# EAGLE design Lüftersteuerung (EAGLE 7.7.0)
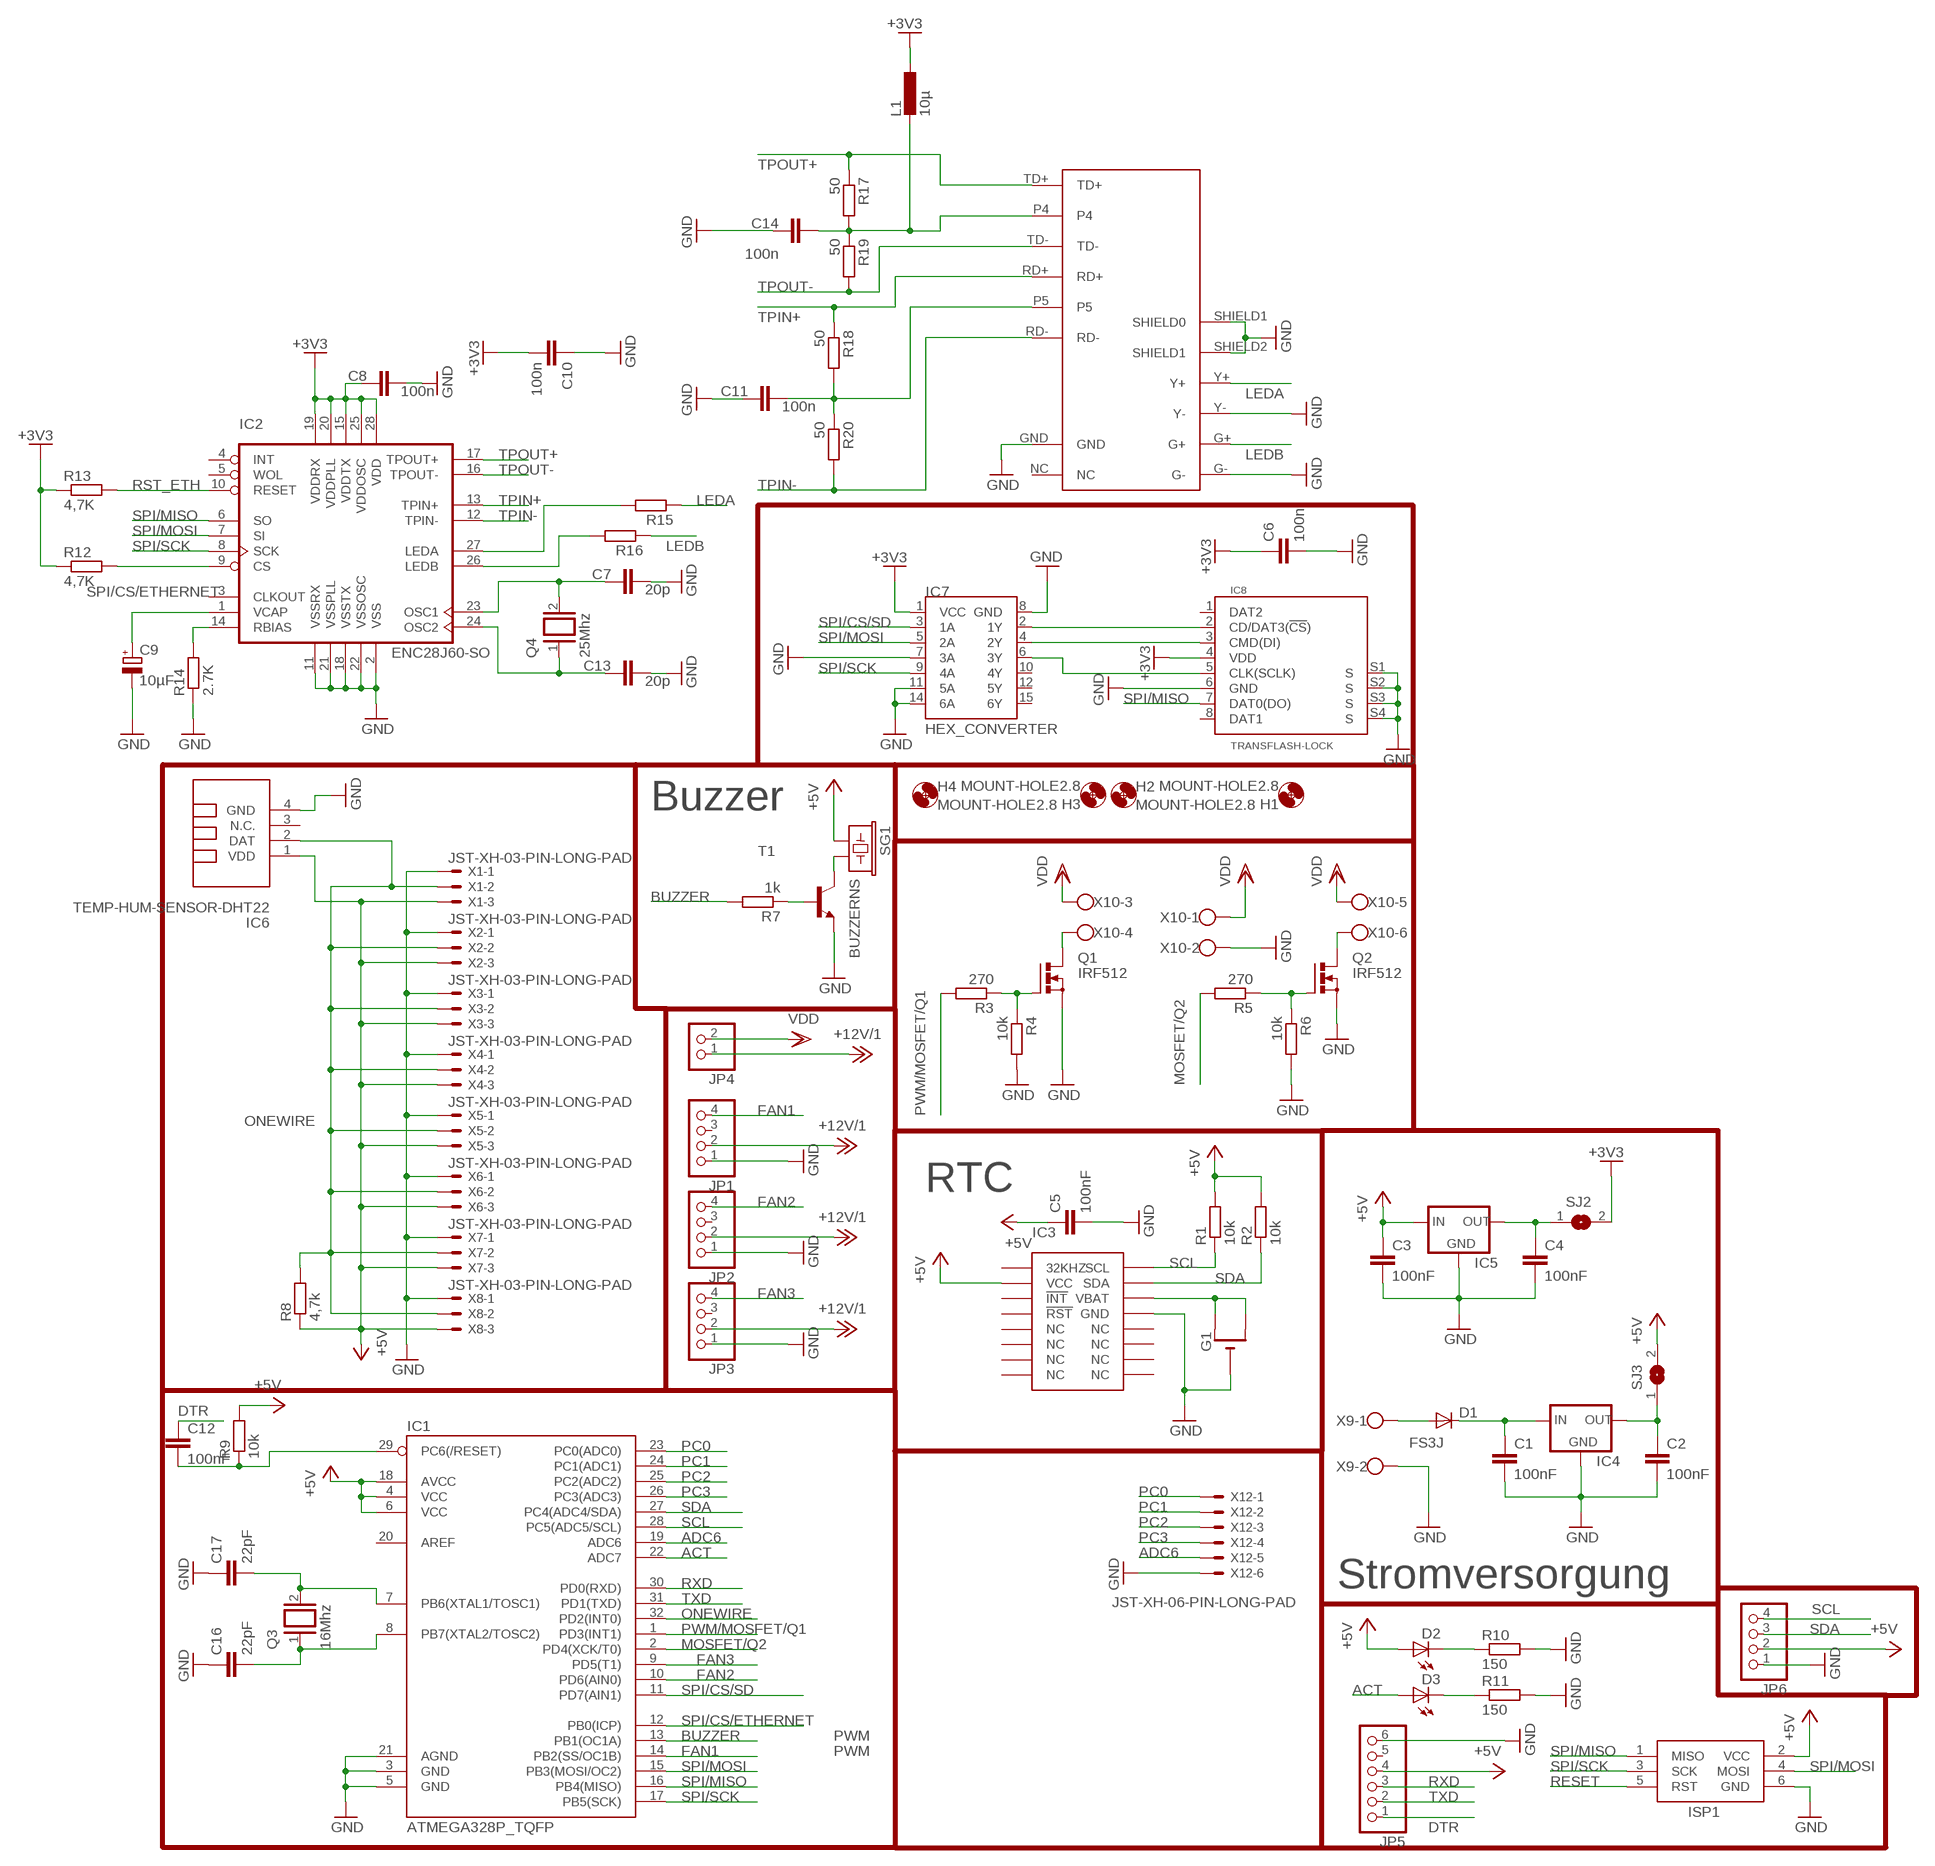
[diagram p0: schematic, sheet 1]

## Parts
C1  100nF  C-EUC1206  [C1206]
C2  100nF  C-EUC1206  [C1206]
C3  100nF  C-EUC1206  [C1206]
C4  100nF  C-EUC1206  [C1206]
C5  100nF  C-EUC1206  [C1206]
C6  100n  C-EUC1206  [C1206]
C7  20p  C-EUC1206  [C1206]
C8  100n  C-EUC1206  [C1206]
C9  10µF  CPOL-EUA/3216-18W  [A/3216-18W]
C10  100n  C-EUC1206  [C1206]
C11  100n  C-EUC1206  [C1206]
C12  100nF  C-EUC1206K  [C1206K]
C13  20p  C-EUC1206  [C1206]
C14  100n  C-EUC1206  [C1206]
C16  22pF  C-EUC1206K  [C1206K]
C17  22pF  C-EUC1206K  [C1206K]
D1  FS3J  DIODE-SMC  [SMC]
D2  LED3MM  [LED3MM]
D3  LED3MM  [LED3MM]
G1  CR1220SMT  [CR1220-SMD]
H1  MOUNT-HOLE2.8  [2,8]
H2  MOUNT-HOLE2.8  [2,8]
H3  MOUNT-HOLE2.8  [2,8]
H4  MOUNT-HOLE2.8  [2,8]
IC1  ATMEGA328P_TQFP  [TQFP32-08]
IC2  ENC28J60-SO  [SO28W]
IC3  DS3231SOIC-16W  [SOIC-16W]
IC4  LM1117  [SOT223]
IC5  LM1117  [SOT223]
IC6  TEMP-HUM-SENSOR-DHT22  [TEMP-HUM-SENSOR-DHT22]
IC7  HEX_CONVERTER  [SO016]
IC8  TRANSFLASH-LOCK  [TRANSFLASH-LOCK-SOCK]
ISP1  AVRISP-6  [AVRISP]
JP1  PINHD-1X4  [1X04]
JP2  PINHD-1X4  [1X04]
JP3  PINHD-1X4  [1X04]
JP4  PINHD-1X2  [1X02]
JP5  PINHD-1X6  [1X06]
JP6  PINHD-1X4  [1X04]
L1  10µ  L-EUL0805  [L0805]
Q1  IRF512  [TO220BV]
Q2  IRF512  [TO220BV]
Q3  16Mhz  XTAL/S  [QS]
Q4  25Mhz  XTAL/S  [QS]
R1  10k  R-EU_R1206  [R1206]
R2  10k  R-EU_R1206  [R1206]
R3  270  R-EU_R1206  [R1206]
R4  10k  R-EU_R1206  [R1206]
R5  270  R-EU_R1206  [R1206]
R6  10k  R-EU_R1206  [R1206]
R7  1k  R-EU_R1206  [R1206]
R8  4,7k  R-EU_R1206  [R1206]
R9  10k  R-EU_M1206  [M1206]
R10  150  R-EU_M1206  [M1206]
R11  150  R-EU_M1206  [M1206]
R12  4,7K  R-EU_R1206  [R1206]
R13  4,7K  R-EU_R1206  [R1206]
R14  2.7K  R-EU_R1206  [R1206]
R15  R-EU_R1206  [R1206]
R16  R-EU_R1206  [R1206]
R17  50  R-EU_R1206  [R1206]
R18  50  R-EU_R1206  [R1206]
R19  50  R-EU_R1206  [R1206]
R20  50  R-EU_R1206  [R1206]
SG1  BUZZERNS  [BUZZER-12MM-NS]
SJ2  SJ  [SJ]
SJ3  SJ  [SJ]
T1  BC817-16-NPN-SOT23-BEC  [SOT23-BEC]
U$1  HR911105A  [RJ45]
X1  JST-XH-03-PIN-LONG-PAD  [JST-XH-03-PACKAGE-LONG-PAD]
X2  JST-XH-03-PIN-LONG-PAD  [JST-XH-03-PACKAGE-LONG-PAD]
X3  JST-XH-03-PIN-LONG-PAD  [JST-XH-03-PACKAGE-LONG-PAD]
X4  JST-XH-03-PIN-LONG-PAD  [JST-XH-03-PACKAGE-LONG-PAD]
X5  JST-XH-03-PIN-LONG-PAD  [JST-XH-03-PACKAGE-LONG-PAD]
X6  JST-XH-03-PIN-LONG-PAD  [JST-XH-03-PACKAGE-LONG-PAD]
X7  JST-XH-03-PIN-LONG-PAD  [JST-XH-03-PACKAGE-LONG-PAD]
X8  JST-XH-03-PIN-LONG-PAD  [JST-XH-03-PACKAGE-LONG-PAD]
X9  W237-102  [W237-102]
X10  W237-6  [W237-6]
X12  JST-XH-06-PIN-LONG-PAD  [JST-XH-06-PACKAGE-LONG-PAD]

## Nets
+3V3: C6.1 C8.1 C10.2 IC2.15(VDDTX) IC2.19(VDDRX) IC2.20(VDDPLL) IC2.25(VDDOSC) IC2.28(VDD) IC7.1(VCC) IC8.4(VDD) L1.1 R12.1 R13.1 SJ2.2
+5V: C3.1 C5.1 D2.A IC1.4(VCC) IC1.6(VCC) IC1.18(AVCC) IC3.2(VCC) IC5.3(IN) IC6.1(VDD) ISP1.2(VCC) JP5.4 JP6.2 R1.2 R2.2 R8.1 R9.2 SG1.+ SJ3.2 X1.3 X2.3 X3.3 X4.3 X5.3 X6.3 X7.3 X8.3
+12V/1: JP1.2 JP2.2 JP3.2 JP4.1
ACT: D3.A IC1.22(ADC7)
ADC6: IC1.19(ADC6) X12.5
BUZZER: IC1.13(PB1(OC1A)) R7.2
DTR: C12.1 JP5.1
FAN1: IC1.14(PB2(SS/OC1B)) JP1.4
FAN2: IC1.10(PD6(AIN0)) JP2.4
FAN3: IC1.9(PD5(T1)) JP3.4
GND: C1.2 C2.2 C3.2 C4.2 C5.2 C6.2 C7.2 C8.2 C9.- C10.1 C11.1 C13.1 C14.1 C16.1 C17.1 G1.- IC1.3(GND) IC1.5(GND) IC1.21(AGND) IC2.2(VSS) IC2.11(VSSRX) IC2.18(VSSTX) IC2.21(VSSPLL) IC2.22(VSSOSC) IC3.13(GND) IC4.1(GND) IC5.1(GND) IC6.4(GND) IC7.7(3A) IC7.8(GND) IC7.11(5A) IC7.14(6A) IC8.6(GND) IC8.S1(S) IC8.S2(S) IC8.S3(S) IC8.S4(S) ISP1.6(GND) JP1.1 JP2.1 JP3.1 JP5.6 JP6.1 Q1.S Q2.S R4.2 R6.2 R10.2 R11.2 R14.1 T1.E U$1.G- U$1.GND U$1.SHIELD1(SHIELD0) U$1.SHIELD2(SHIELD1) U$1.Y- X1.1 X2.1 X3.1 X4.1 X5.1 X6.1 X7.1 X8.1 X9.2 X10.2 X12.6
LEDA: R15.1 U$1.Y+
LEDB: R16.1 U$1.G+
MOSFET/Q2: IC1.2(PD4(XCK/T0)) R5.2
N$1: D1.A X9.1
N$2: C1.1 D1.C IC4.3(IN)
N$3: C2.1 IC4.2(OUT) SJ3.1
N$4: G1.+$1(+) G1.+$2(+1) IC3.14(VBAT)
N$5: Q1.D X10.4
N$6: Q1.G R3.1 R4.1
N$7: Q2.D X10.6
N$8: SG1.- T1.C
N$9: Q2.G R5.1 R6.1
N$10: R7.1 T1.B
N$11: C16.2 IC1.8(PB7(XTAL2/TOSC2)) Q3.1
N$12: C17.2 IC1.7(PB6(XTAL1/TOSC1)) Q3.2
N$13: D2.K(C) R10.1
N$14: D3.K(C) R11.1
N$15: IC7.2(1Y) IC8.2(CD/DAT3(!CS!))
N$16: IC7.4(2Y) IC8.3(CMD(DI))
N$17: IC7.6(3Y) IC8.5(CLK(SCLK))
N$18: C13.2 IC2.24(OSC2) Q4.1
N$19: IC2.14(RBIAS) R14.2
N$20: C7.1 IC2.23(OSC1) Q4.2
N$21: C9.+ IC2.1(VCAP)
N$22: C14.2 L1.2 R17.2 R19.1 U$1.P4
N$23: IC2.26(LEDB) R16.2
N$24: IC2.27(LEDA) R15.2
N$26: C11.2 R18.2 R20.1 U$1.P5
N$42: C4.1 IC5.2(OUT) SJ2.1
ONEWIRE: IC1.32(PD2(INT0)) IC6.2(DAT) R8.2 X1.2 X2.2 X3.2 X4.2 X5.2 X6.2 X7.2 X8.2
PC0: IC1.23(PC0(ADC0)) X12.1
PC1: IC1.24(PC1(ADC1)) X12.2
PC2: IC1.25(PC2(ADC2)) X12.3
PC3: IC1.26(PC3(ADC3)) X12.4
PWM/MOSFET/Q1: IC1.1(PD3(INT1)) R3.2
RESET: C12.2 IC1.29(PC6(/RESET)) ISP1.5(RST) R9.1
RST_ETH: IC2.10(RESET) R13.2
RXD: IC1.30(PD0(RXD)) JP5.3
SCL: IC1.28(PC5(ADC5/SCL)) IC3.16(SCL) JP6.4 R1.1
SDA: IC1.27(PC4(ADC4/SDA)) IC3.15(SDA) JP6.3 R2.1
SPI/CS/ETHERNET: IC1.12(PB0(ICP)) IC2.9(CS) R12.2
SPI/CS/SD: IC1.11(PD7(AIN1)) IC7.3(1A)
SPI/MISO: IC1.16(PB4(MISO)) IC2.6(SO) IC8.7(DAT0(DO)) ISP1.1(MISO)
SPI/MOSI: IC1.15(PB3(MOSI/OC2)) IC2.7(SI) IC7.5(2A) ISP1.4(MOSI)
SPI/SCK: IC1.17(PB5(SCK)) IC2.8(SCK) IC7.9(4A) ISP1.3(SCK)
TPIN+: IC2.13(TPIN+) R18.1 U$1.RD+
TPIN-: IC2.12(TPIN-) R20.2 U$1.RD-
TPOUT+: IC2.17(TPOUT+) R17.1 U$1.TD+
TPOUT-: IC2.16(TPOUT-) R19.2 U$1.TD-
TXD: IC1.31(PD1(TXD)) JP5.2
VDD: JP4.2 X10.1 X10.3 X10.5
Unconnected: IC1.20(AREF) IC2.3(CLKOUT) IC2.4(INT) IC2.5(WOL) IC3.1(32KHZ) IC3.3(!INT) IC3.4(!RST) IC3.5(NC) IC3.6(NC) IC3.7(NC) IC3.8(NC) IC3.9(NC) IC3.10(NC) IC3.11(NC) IC3.12(NC) IC6.3(N.C.) IC7.10(4Y) IC7.12(5Y) IC7.15(6Y) IC8.1(DAT2) IC8.8(DAT1) JP1.3 JP2.3 JP3.3 JP5.5 U$1.NC

## Notes on the sheet
- Buzzer
- RTC
- Stromversorgung
- PWM
- PWM

## Library data of the parts
C1-C8 C10-C14 C16 C17 = rcl:C-EU: CAPACITOR, European symbol
C9 = rcl:CPOL-EU: POLARIZED CAPACITOR, European symbol
D1 = diode-1:DIODE-: DIODE
D2 D3 = SparkFun:LED: LEDs Standard schematic elements and footprints for 5mm, 3mm, 1206, and 0603 sized LEDs. 5mm - Spark Fun Electronics SKU : COM-00529 (and others)
G1 = adafruit:CR1220: CR1216/CR1220/CR1225 12mm 3V lithium coin cell Great for battery packup. Both SMT and THM holders. Note the THM package has the ground pads on both sides of the PCB so that the masks are the same - this reduces the cost
H1-H4 = holes:MOUNT-HOLE: MOUNTING HOLE with drill center marker
IC1 = SparkFun-IC-Microcontroller:ATMEGA328P_TQFP: Popular 328P in QFP Storefront component: ATmega328 - TQFP <https://www.sparkfun.com/products/13448> (COM-13448) Datasheet <http://www.sparkfun.com/datasheets/Components/SMD/ATMega328.pdf> SparkFun Products SparkFun RedBoard - Programmed with Arduino <https://www.sparkfun.com/products/12757> (DEV-12757) Arduino Pro Mini 328 - 5V/16MHz <https://www.sparkfun.com/products/11113> (DEV-11113) Arduino Pro Mini 328 - 3.3V/8MHz <https://www.sparkfun.com/products/11114> (DEV-11114) SparkFun OpenLog <https://www.sparkfun.com/products/13712> (DEV-13712) SparkFun MicroView - OLED Arduino Module <https://www.sparkfun.com/products/12923> (DEV-12923) SparkFun Digital Sandbox <https://www.sparkfun.com/products/12651> (DEV-12651) SparkFun PicoBoard <https://www.sparkfun.com/products/11888> (WIG-11888) Arduino Fio <https://www.sparkfun.com/products/10116> (DEV-10116) LilyPad Arduino 328 Main Board <https://www.sparkfun.com/products/13342> (DEV-13342) SparkFun RedStick <https://www.sparkfun.com/products/13741> (DEV-13741) LilyPad MP3 <https://www.sparkfun.com/products/11013> (DEV-11013) LilyPad Arduino SimpleSnap <https://www.sparkfun.com/products/10941> (DEV-10941) SparkFun Stepoko <https://www.sparkfun.com/products/13899> (ROB-13899) SparkFun Geiger Counter <https://www.sparkfun.com/products/11345> (SEN-11345) SparkFun EL Sequencer <https://www.sparkfun.com/products/12781> (COM-12781) Arduino Pro 328 - 5V/16MHz <https://www.sparkfun.com/products/10915> (DEV-10915) CryptoCape <https://www.sparkfun.com/products/12773> (DEV-12773) SparkFun IR Thermometer Evaluation Board - MLX90614 <https://www.sparkfun.com/products/10740> (SEN-10740) SparkFun RedBot Mainboard <https://www.sparkfun.com/products/12097> (ROB-12097) Arduino Pro 328 - 3.3V/8MHz <https://www.sparkfun.com/products/10914> (DEV-10914) SparkFun Block for Intel® Edison - Arduino <https://www.sparkfun.com/products/13036> (DEV-13036) SparkFun Simon Says - Surface Mount Soldering Kit <https://www.sparkfun.com/products/10935> (KIT-10935) SparkFun 7-Segment Serial Display - Red <https://www.sparkfun.com/products/11441> (COM-11441) SparkFun 7-Segment Serial Display - White <https://www.sparkfun.com/products/11629> (COM-11629) SparkFun 7-Segment Serial Display - Yellow <https://www.sparkfun.com/products/11443> (COM-11443) SparkFun 7-Segment Serial Display - Kelly Green <https://www.sparkfun.com/products/11440> (COM-11440) SparkFun 7-Segment Serial Display - Blue <https://www.sparkfun.com/products/11442> (COM-11442) SparkFun OpenSegment Serial Display - 20mm (Blue) <https://www.sparkfun.com/products/11647> (COM-11647) SparkFun OpenSegment Serial Display - 20mm (Green) <https://www.sparkfun.com/products/11646> (COM-11646) SparkFun OpenSegment Serial Display - 20mm (White) <https://www.sparkfun.com/products/11648> (COM-11648) SparkFun OpenSegment Serial Display - 20mm (Red) <https://www.sparkfun.com/products/11644> (COM-11644) SparkFun OpenSegment Serial Display - 20mm (Yellow) <https://www.sparkfun.com/products/11645> (COM-11645) SparkFun OpenSegment Shield <https://www.sparkfun.com/products/13190> (DEV-13190); PROD_ID: IC-09069
IC2 = microchip-enc28j60:ENC28J60-*: Microchip 10Mbit Eth. contoller with SPI interface
IC3 = DS3231_industrialberry:DS3231
IC4 IC5 = v-reg-2:LM1117
IC6 = diy-modules:TEMP-HUM-SENSOR-DHT22: DHT22 - digital humidity & temperature sensor Also known as: AM2302 AM2302 datasheet available here: http://akizukidenshi.com/download/ds/aosong/AM2302.pdf Click here to find device on ebay.com <http://www.ebay.com/sch/dht22+digital+sensor>
IC7 = SparkFun-DigitalIC:HEX_CONVERTER: 74HC4050 Hex Buffer Level Shifter SMD SO016; PROD_ID: IC-09604
IC8 = SD-Kartenhalter:TRANSFLASH: TransFlash TF Micro SD Card Socket Adapter
ISP1 = adafruit:AVRISP: AVR ISP HEADER Standard 6 pin header for AVR programming
JP1-JP3 JP6 = pinhead:PINHD-1X4: PIN HEADER
JP4 = pinhead:PINHD-1X2: PIN HEADER
JP5 = pinhead:PINHD-1X6: PIN HEADER
L1 = rcl:L-EU: INDUCTOR, European symbol
Q1 Q2 = transistor-power:IRF512: N-CHANNEL MOS FET
Q3 Q4 = special:XTAL/S: CRYSTAL
R1-R20 = rcl:R-EU_: RESISTOR, European symbol
SG1 = SparkFun:BUZZER: Buzzer 12mm Spark Fun Electronics SKU : Comp-Buzzer
SJ2 SJ3 = jumper:SJ: SMD solder JUMPER
T1 = transistor:*-NPN-: NPN Transistror BF959 corrected 2008.03.06
U$1 = HR911105A:HR911105A
X1-X8 = Rembrandt Electronics - JST XH Connectors v1-0:JST-XH-03-PIN: JST XH Connector 2 Pin Wire to board connector. Pitch: 2,54 mm, (0.100") Number of pins: 3 Created by Rembrandt Electronics www.rembrandtelectronics.com
X9 = con-wago-500:W237-102: WAGO SCREW CLAMP
X10 = con-wago-500:W237-6: WAGO SCREW CLAMP
X12 = Rembrandt Electronics - JST XH Connectors v1-0:JST-XH-06-PIN: JST XH Connector 2 Pin Wire to board connector. Pitch: 2,54 mm, (0.100") Number of pins: 6 Created by Rembrandt Electronics www.rembrandtelectronics.com

## Board
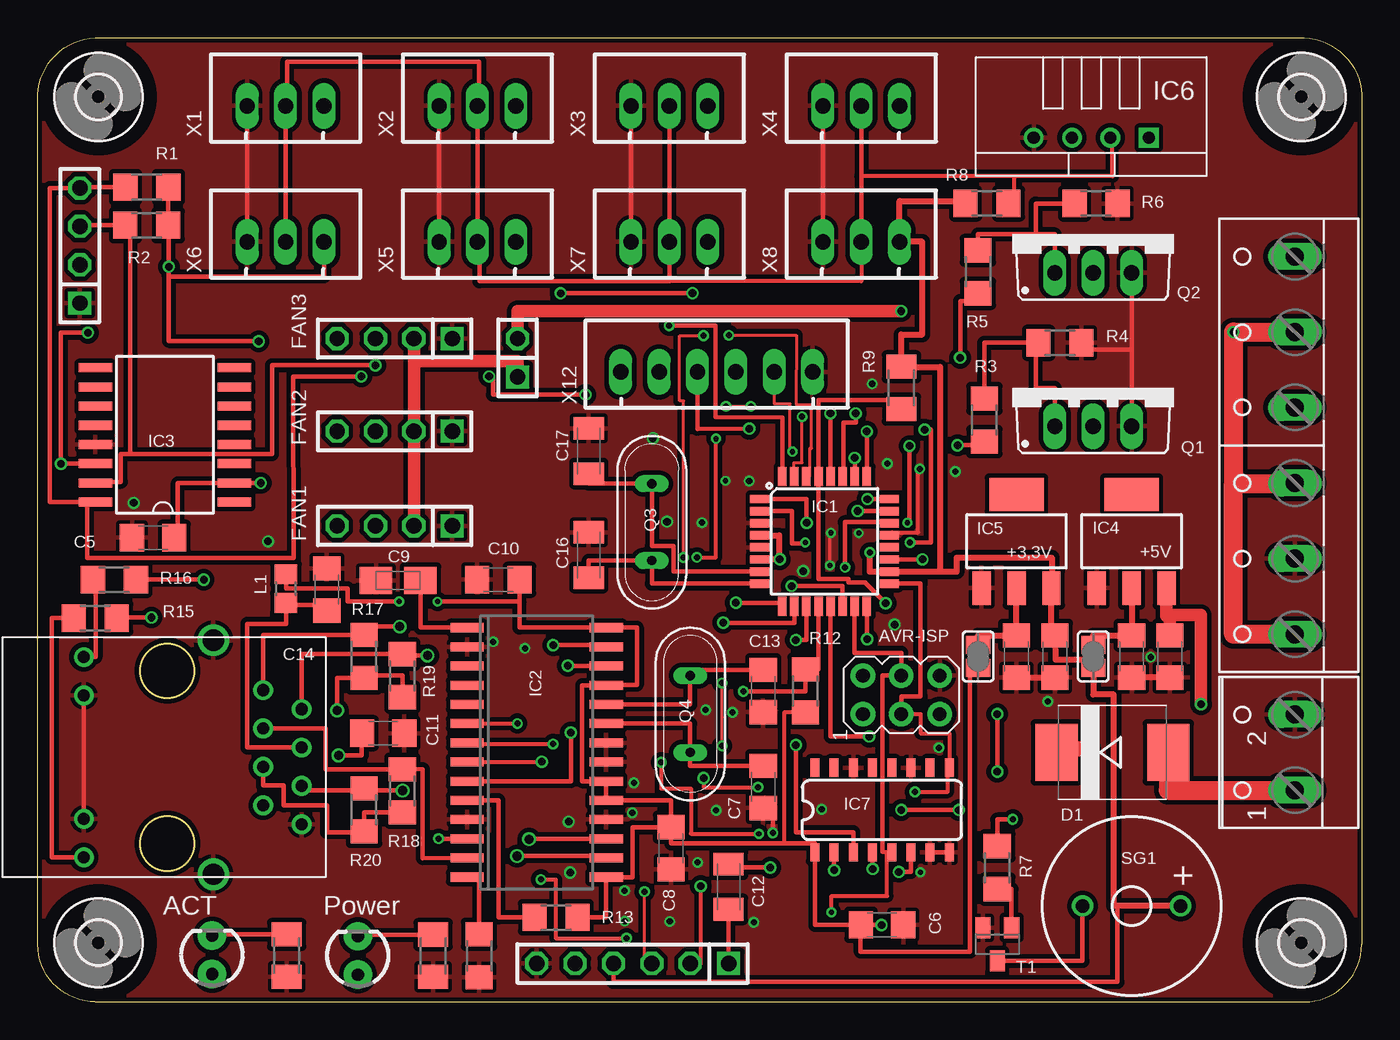
[diagram p1: board, top side]
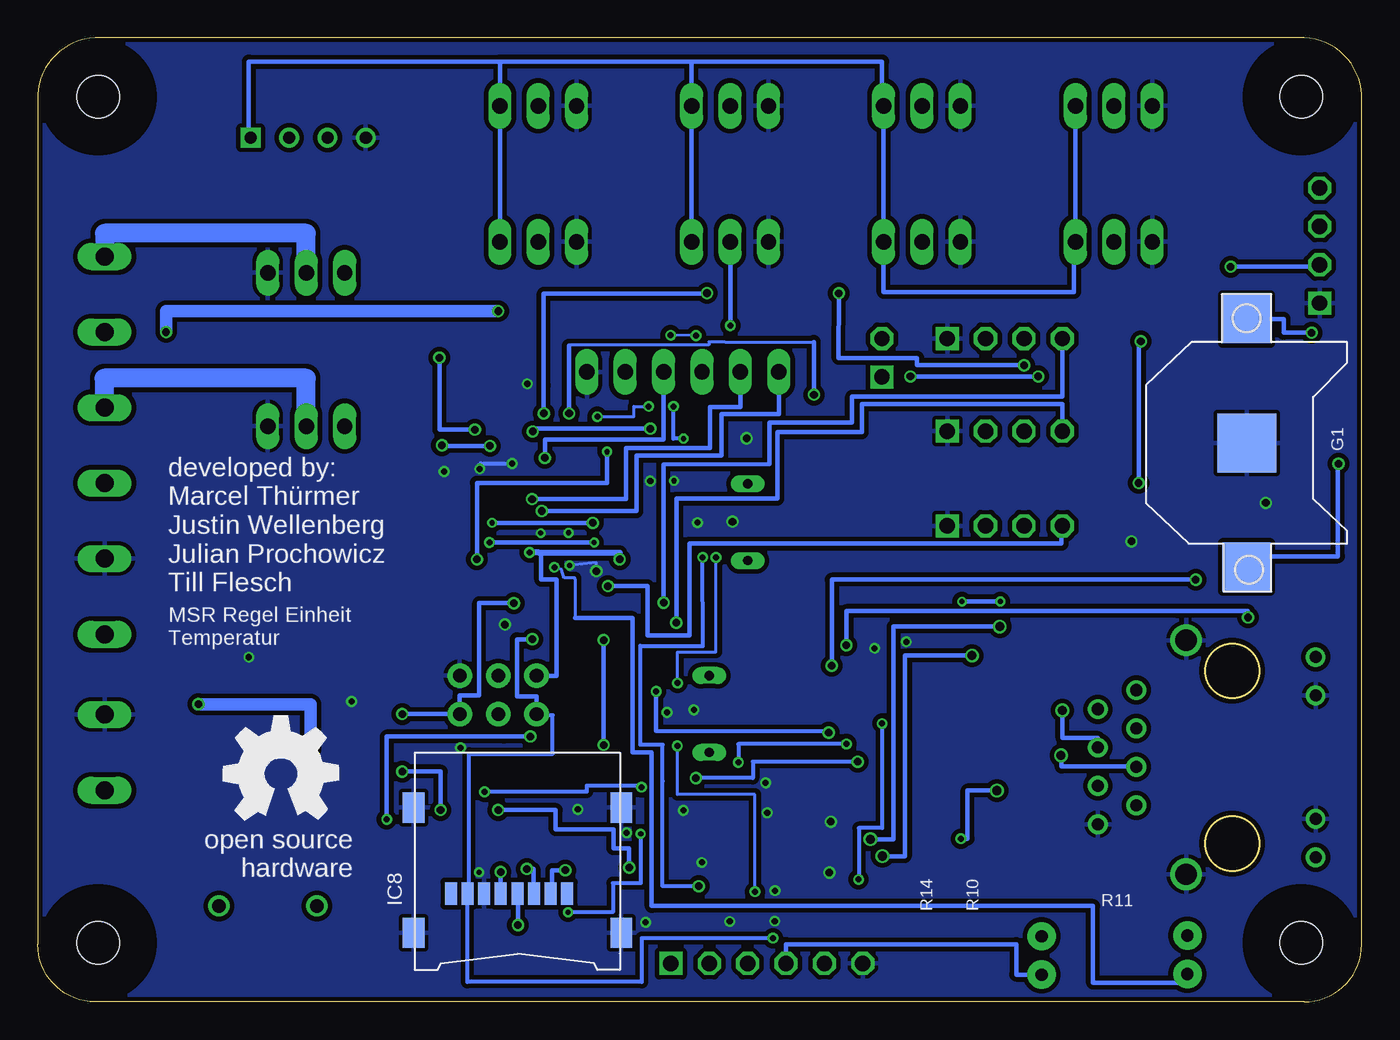
[diagram p2: board, bottom side, seen from below]

Size 87.62 x 63.81 mm. Coordinates in mm from the lower left corner, seen from the top.
Outline: 83.81,0 3.81,0 arc-90 0,3.81 0,59.69 arc-90 3.81,63.81 83.82,63.81 arc-90 87.62,59.69 87.62,3.81 arc-90 83.82,0
Copper layers (1*16): Top 0.035mm / dielectric 1.5mm / Bottom 0.035mm
Design rules "SeeedStudio_2layer_DRU_no_angle_20140221 *": minimum track width 6mil, minimum drill 12mil, track to track 6mil, track to pad 6mil, pad to pad 6mil, via to via 6mil, smd to smd 0mil, copper to edge 10mil, drill to drill 0.3mm, minimum pad ring 10mil, minimum via ring 6mil, stop-mask expansion 2mil, vias tented up to drill 0mil, thermal gap 10mil

### Footprints (pad centres in the part's own frame; a part is rotated, then mirrored left to right if it is on the bottom)
C1206 = smd 1.6 x 1.8: 1 -1.4,0; 2 1.4,0
A/3216-18W = smd 2.15 x 1.8: + 1.475,0; - -1.475,0
C1206K = smd 1.5 x 2: 1 -1.5,0; 2 1.5,0
SMC = smd 2.8 x 3.8: A 3.7,0; C -3.7,0
LED3MM = drill 0.813 pad 1.88: A -1.27,0; K 1.27,0
CR1220-SMD = smd 3.2 x 3.2: +$1 -8.2,0; +$2 8.2,0 | smd 3.9 x 3.9: - 0,0
2,8 = hole 2.8: 0,0
TQFP32-08 = smd 1.27 x 0.559: 1 -4.293,2.8; 2 -4.293,2; 3 -4.293,1.2; 4 -4.293,0.4; 5 -4.293,-0.4; 6 -4.293,-1.2; 7 -4.293,-2; 8 -4.293,-2.8; 17 4.293,-2.8; 18 4.293,-2; 19 4.293,-1.2; 20 4.293,-0.4; 21 4.293,0.4; 22 4.293,1.2; 23 4.293,2; 24 4.293,2.8 | smd 0.559 x 1.27: 9 -2.8,-4.293; 10 -2,-4.293; 11 -1.2,-4.293; 12 -0.4,-4.293; 13 0.4,-4.293; 14 1.2,-4.293; 15 2,-4.293; 16 2.8,-4.293; 25 2.8,4.293; 26 2,4.293; 27 1.2,4.293; 28 0.4,4.293; 29 -0.4,4.293; 30 -1.2,4.293; 31 -2,4.293; 32 -2.8,4.293
SO28W = smd 0.6 x 2.2: 1 -8.255,-4.6; 2 -6.985,-4.6; 3 -5.715,-4.6; 4 -4.445,-4.6; 5 -3.175,-4.6; 6 -1.905,-4.6; 7 -0.635,-4.6; 8 0.635,-4.6; 9 1.905,-4.6; 10 3.175,-4.6; 11 4.445,-4.6; 12 5.715,-4.6; 13 6.985,-4.6; 14 8.255,-4.6; 15 8.255,4.6; 16 6.985,4.6; 17 5.715,4.6; 18 4.445,4.6; 19 3.175,4.6; 20 1.905,4.6; 21 0.635,4.6; 22 -0.635,4.6; 23 -1.905,4.6; 24 -3.175,4.6; 25 -4.445,4.6; 26 -5.715,4.6; 27 -6.985,4.6; 28 -8.255,4.6
SOIC-16W = smd 0.6 x 2.2: 1 -4.445,-4.6; 2 -3.175,-4.6; 3 -1.905,-4.6; 4 -0.635,-4.6; 5 0.635,-4.6; 6 1.905,-4.6; 7 3.175,-4.6; 8 4.445,-4.6; 9 4.445,4.6; 10 3.175,4.6; 11 1.905,4.6; 12 0.635,4.6; 13 -0.635,4.6; 14 -1.905,4.6; 15 -3.175,4.6; 16 -4.445,4.6
SOT223 = smd 1.219 x 2.235: 1 -2.311,-3.099; 2 0,-3.099; 3 2.311,-3.099 | smd 3.6 x 2.2: 4 0,3.099
TEMP-HUM-SENSOR-DHT22 = drill 0.8 square: 1 -3.81,0 | drill 0.8: 2 -1.27,0; 3 1.27,0; 4 3.81,0
SO016 = smd 0.6 x 1.2: 1 -4.445,-2.8; 2 -3.175,-2.8; 3 -1.905,-2.8; 4 -0.635,-2.8; 5 0.635,-2.8; 6 1.905,-2.8; 7 3.175,-2.8; 8 4.445,-2.8; 9 4.445,2.8; 10 3.175,2.8; 11 1.905,2.8; 12 0.635,2.8; 13 -0.635,2.8; 14 -1.905,2.8; 15 -3.175,2.8; 16 -4.445,2.8
TRANSFLASH-LOCK-SOCK = smd 0.8 x 1.5: 1 3.3,-0.46; 2 2.2,-0.46; 3 1.1,-0.46; 4 0,-0.46; 5 -1.1,-0.46; 6 -2.2,-0.46; 7 -3.3,-0.46; 8 -4.4,-0.46 | smd 1.45 x 2: S1 -6.875,-3.06; S2 -6.875,5.24; S3 6.875,5.24; S4 6.875,-3.06
AVRISP = drill 0.9 pad 1.626: 1 -1.27,2.54; 2 1.27,2.54; 3 -1.27,0; 4 1.27,0; 5 -1.27,-2.54; 6 1.27,-2.54
1X04 = drill 1.016 square: 1 -3.81,0 | drill 1.016 octagon: 2 -1.27,0; 3 1.27,0; 4 3.81,0
1X02 = drill 1.016 square: 1 -1.27,0 | drill 1.016 octagon: 2 1.27,0
1X06 = drill 1.016 square: 1 -6.35,0 | drill 1.016 octagon: 2 -3.81,0; 3 -1.27,0; 4 1.27,0; 5 3.81,0; 6 6.35,0
L0805 = smd 1.3 x 1.5: 1 -0.95,0; 2 0.95,0
TO220BV = drill 1.016 long: D 0,-2.54; G -2.54,-2.54; S 2.54,-2.54
QS = drill 0.61 long: 1 -2.54,0; 2 2.54,0
R1206 = smd 1.6 x 1.803: 1 -1.422,0; 2 1.422,0
M1206 = smd 1.6 x 2: 1 -1.4,0; 2 1.4,0
BUZZER-12MM-NS = drill 0.9: + 3.25,0; - -3.25,0
SJ = smd 1.168 x 1.6: 1 -0.762,0; 2 0.762,0
SOT23-BEC = smd 1 x 1.4: B -0.95,-1.1; C 0,1.1; E 0.95,-1.1
RJ45 = drill 0.8: G+ 5.84,-6.305; G- 5.84,-3.765; GND -8.57,4.76; NC -6.03,3.5; P4 -8.57,-0.32; P5 -6.03,0.96; RD+ -6.03,-1.58; RD- -8.57,2.22; TD+ -6.03,-4.12; TD- -8.57,-2.86; Y+ 5.84,6.945; Y- 5.84,4.405 | drill 1.4: SHIELD1 -2.73,-7.425; SHIELD2 -2.73,8.065
JST-XH-03-PACKAGE-LONG-PAD = drill 1.016 long: 1 -2.54,0; 2 0,0; 3 2.54,0
W237-102 = drill 1.194 long: 1 -2.5,-1.27; 2 2.5,-1.27
W237-6 = drill 1.194 long: 1 -12.5,-1.27; 2 -7.5,-1.27; 3 -2.5,-1.27; 4 2.5,-1.27; 5 7.5,-1.27; 6 12.5,-1.27
JST-XH-06-PACKAGE-LONG-PAD = drill 1.016 long: 1 -6.35,0; 2 -3.81,0; 3 -1.27,0; 4 1.27,0; 5 3.81,0; 6 6.35,0

### Placement (x,y rotation side)
C1  74.93,22.86 270 top
C2  72.39,22.86 270 top
C3  67.31,22.86 270 top
C4  64.77,22.86 270 top
C5  7.63,30.72 180 top
C6  55.87,5.1 0 top
C7  48.01,14.22 270 top
C8  41.91,10.16 270 top
C9  23.85,27.9 0 top
C10  30.48,27.94 0 top
C11  22.86,17.78 180 top
C12  45.72,7.62 90 top
C13  48.01,20.57 90 top
C14  19.13,27.29 270 top
C16  36.46,29.58 270 top
C17  36.46,36.46 270 top
D1  71.12,16.51 0 top
D2  21.19,3.07 90 top
D3  11.54,3.11 90 top
G1  7.62,36.99 270 bottom
H1  83.62,59.9 0 top
H2  83.62,3.91 0 top
H3  4.01,3.91 0 top
H4  4.01,59.9 0 top
IC1  52.07,30.48 0 top
IC2  33.02,16.51 270 top
IC3  8.41,37.53 90 top
IC4  72.39,30.48 0 top
IC5  64.77,30.48 0 top
IC6  69.72,57.2 180 top
IC7  55.88,12.7 0 top
IC8  55.88,7.62 0 bottom
ISP1  57.15,20.32 90 top
JP1  23.62,31.51 180 top
JP2  23.62,37.76 180 top
JP3  23.62,43.9 180 top
JP4  31.75,42.63 90 top
JP5  39.37,2.54 180 top
JP6  2.78,50.06 90 top
L1  16.43,27.35 270 top
Q1  69.85,40.64 0 top
Q2  69.85,50.8 0 top
Q3  40.64,31.75 90 top
Q4  43.18,19.05 270 top
R1  7.23,53.92 0 top
R2  7.21,51.4 0 top
R3  62.64,38.51 270 top
R4  67.65,43.63 0 top
R5  62.22,48.31 270 top
R6  70.04,52.84 0 top
R7  63.5,8.89 90 top
R8  62.82,52.85 0 top
R9  57.15,40.64 90 top
R10  26.16,3.05 270 top
R11  16.48,3.06 270 top
R12  50.8,20.57 90 top
R13  34.29,5.59 180 top
R14  29.21,3.05 90 top
R15  3.81,25.4 0 top
R16  5.08,27.94 0 top
R17  21.59,22.86 270 top
R18  24.13,13.97 270 top
R19  24.13,21.59 90 top
R20  21.59,12.7 90 top
SG1  72.39,6.35 0 top
SJ2  62.23,22.86 270 top
SJ3  69.85,22.86 270 top
T1  63.5,3.81 180 top
U$1  8.89,16.51 180 top
U$2  [OSHW_8MM]  71.55,15.08 0 bottom
X1  16.4,59.3 0 top
X2  29.1,59.3 0 top
X3  41.8,59.3 0 top
X4  54.5,59.3 0 top
X5  29.1,50.3 0 top
X6  16.4,50.3 0 top
X7  41.8,50.3 0 top
X8  54.5,50.3 0 top
X9  81.93,16.51 90 top
X10  81.93,36.83 90 top
X12  44.93,41.7 0 top

### Tracks (layer width: path | path; a pad name or v marks a point on that pad's centre or on a via)
+3V3  (via drill 0.34, 0.35, 0.5)
  Top 0.254: R12.1 49.39,19.15 49.39,10.49
  Top 0.305: C6.1 51.44,5.09 IC7.1 51.44,10.49 49.39,10.49 41.91,10.49 C8.1 | C6.1 54.47,5.08 v55.84,5.08 | C8.1 41.91,13.34 IC2.19 IC2.20 36.04,14.61 36.04,16.16 36.02,16.16 36.02,20.95 IC2.25 37.62,20.98 39.65,20.98 39.65,24.77 IC2.28 31.88,24.77 31.88,26.42 | C8.1 39.37,11.56 39.37,8.26 IC2.15 37.62,5.59 R13.1 | SJ2.2 61.69,22.1 61.69,3.32 54.46,3.32 54.46,5.1 C6.1 | 31.88,26.42 C10.2 | L1.1 16.43,27.38 20.5,27.38 20.49,26.5 v23.91,26.5 | v26.45,26.49 31.81,26.49 arc-90 31.88,26.42
  Bottom 0.305: v55.84,5.08 55.84,7.16 IC8.4 | v23.91,26.5 v23.91,26.49 v26.45,26.49
+5V  (via drill 0.4, 0.5)
  Top 0.254: 61.4,53.01 R8.1
  Top 0.305: C5.1 9.27,30.72 9.27,34.34 12.47,34.34 IC3.2 12.47,34.34 v14.76,34.34 | R1.2 8.64,53.92 R2.2 8.67,51.4 v8.67,48.65 v8.68,48.65 8.68,48 | X6.3 18.94,48 8.68,48 | 8.68,48 8.68,43.73 14.62,43.73 v14.62,43.71 | JP5.4 38.1,1.32 48.32,1.32 71.46,1.32 71.46,6.35 | 60.82,28.48 55.07,28.48
  Top 0.406: SG1.+ 71.46,6.35 71.2,6.35 71.2,20.33 69.85,20.33 SJ3.2 69.87,22.64 67.38,22.64 67.36,24.16 | 67.36,24.16 67.36,24.26 | 67.33,27.38 IC5.3 | IC5.3 67.08,24.49 arc90 C3.1 67.36,24.26 67.36,24.16 | IC1.18 | IC1.18 59.7,28.48 | 59.7,28.48 60.82,28.48 | 60.8,28.48 60.82,28.48 60.82,29.41 67.1,29.41 67.1,27.38 IC5.3 | v49.11,29.3 49.06,29.29 49.06,29.28 | 49.06,29.28 IC1.6 | IC1.4 49.06,30.88 49.06,29.28 | 59.7,28.48 59.7,42.02 57.15,42.02 R9.2 57.15,44.18 58.54,44.18 58.54,50.3 X8.3 57.04,53.01 61.4,53.01 | 55.06,28.48 55.19,28.48 | 55.19,28.48 IC1.18 | v55.07,29.74 55.07,28.48 55.19,28.48
  Bottom 0.305: X7.3 X3.3 44.34,62.23 | 44.34,62.23 57.04,62.23 | 57.04,62.23 X4.3 X8.3 | 44.34,62.23 31.75,62.23 31.75,59.3 X2.3 X5.3 31.64,46.99 19.05,46.99 19.05,50.3 X6.3 X1.3 | 57.04,62.23 73.66,62.23 73.66,57.2 IC6.1 | JP6.2 2.78,48.65 v8.67,48.65 | D2.A 22.86,1.8 22.86,3.81 38.1,3.81 JP5.4 | 54.3,29.72 54.31,27.95 53.27,27.95 53.27,21.58 ISP1.2 | v14.62,43.71 14.76,43.71 v14.76,34.34
  Bottom 0.406: v49.11,29.3 49.1,29.72 54.3,29.72 54.47,29.73 v55.07,29.74
+12V/1
  Top 0.813: 24.89,42.41 JP2.2 JP1.2 | 24.89,42.41 JP3.2 | JP4.1 31.75,42.41 24.89,42.41
ACT  (via drill 0.4)
  Top 0.305: IC1.22 56.36,31.75 53.41,31.75 v53.43,28.76
  Bottom 0.203: 52.07,25.4 52.07,27.98 52.07,28.07 52.78,28.07 52.97,28.63 v53.43,28.76
  Bottom 0.305: D3.A 11.54,1.27 17.78,1.27 17.78,6.35 46.99,6.35 46.99,16.51 48.26,16.51 48.26,25.4 52.07,25.4
ADC6  (via drill 0.35, 0.5)
  Top 0.203: v49.95,36.41 49.79,36.41 49.79,39.57 48.74,39.57 X12.5
  Top 0.305: v58.55,29.28 IC1.19
  Bottom 0.305: v49.95,36.41 49.94,34.35 58.55,34.34 v58.55,29.28 | v58.55,29.28
BUZZER  (via drill 0.4, 0.5)
  Top 0.305: IC1.13 52.47,17.56 v55.02,17.56 | v64.52,12.07 63.5,12.07 R7.2
  Bottom 0.305: v55.02,17.56 56.78,17.56 64.52,17.56 v64.52,12.07
DTR
  Top 0.305: JP5.1 C12.1
FAN1  (via drill 0.5)
  Top 0.305: IC1.14 53.24,26.19 53.24,27.53 49.88,27.53 v49.88,27.52
  Bottom 0.305: v49.88,27.52 47.27,27.52 47.27,24.24 44.5,24.24 44.5,30.33 19.87,30.33 19.87,31.51 JP1.4
FAN2  (via drill 0.5)
  Top 0.305: IC1.10 50.07,25.09 v45.36,25.09
  Bottom 0.305: v45.36,25.09 45.36,33.3 38.67,33.3 38.67,37.71 33.08,37.71 33.08,39.56 19.81,39.56 JP2.4
FAN3  (via drill 0.5)
  Top 0.305: IC1.9 49.27,26.41 v46.2,26.41
  Bottom 0.305: v46.2,26.41 46.2,35.56 39.19,35.58 39.19,38.34 33.73,38.34 33.73,40.06 19.81,40.06 JP3.4
GND  (via drill 0.33, 0.35, 0.36, 0.4, 0.5)
  Top 0.203: v52.43,28.88 52.43,31.05 v52.49,31.05
  Top 0.254: IC1.21 56.55,31.07 58.26,31.07 58.26,35.29
  Top 0.305: IC7.8 IC7.7 | R4.2 69.07,43.18 72.39,43.18 | 72.39,43.18 Q2.S | Q1.S 72.39,43.18 | X6.1 X1.1 | X5.1 X2.1 | X7.1 X3.1 | X8.1 X4.1 | U$1.Y- U$1.G- | C7.2 48.65,12.18 v48.65,11.18
  Top 0.406: C1.2 C2.2 | C4.2 C3.2
  Bottom 0.203: v50.65,28.51 50.65,29.07 v52.43,28.88
  Bottom 0.254: 58.57,35.29 58.47,35.39 58.47,35.47 58.31,35.63 v56.23,35.63
  other vias: 15.24,30.48 6.35,33.02 35.23,8.56 35.13,11.92 39.34,12.5 39.45,14.49 38.83,7.35 38.85,5.34 41.83,5.32 44.9,12.67 43.67,9.23 58.42,8.57 73.65,22.81 66.84,19.88 54.34,31.03 47.08,34.47 45.51,34.49 60.73,35.1 56.7,24.97 58.37,35.28 55.22,40.91 45.97,19.16 44.2,19.33 47.39,5.27 51.88,12.74 59.63,16.82 32.24,23.4 30.14,23.83 40.71,37.3 41.64,31.78 43.95,31.71
  pour Top (isolate 0.305): 3.81,63.5 arc90 0,59.69 0,3.81 arc90 3.81,0 83.82,0 arc90 87.63,3.81 87.63,59.69 arc90 83.82,63.5
  pour Bottom (isolate 0.305): 3.81,63.5 arc90 0,59.69 0,58.42 0,3.81 arc90 3.81,0 83.82,0 arc90 87.63,3.81 87.63,59.69 arc90 83.82,63.5
LEDA
  Top 0.305: R15.1 0.94,25.4 0.94,9.56 U$1.Y+
LEDB
  Top 0.305: R16.1 3.82,27.94 3.82,22.82 U$1.G+
MOSFET/Q2  (via drill 0.34, 0.4, 0.5)
  Top 0.305: IC1.2 49.91,32.48 49.91,30.32 50.8,30.32 v50.8,30.4 | v57.73,30.41 59.11,30.39 59.11,37.86 58.74,37.86 v58.69,37.87 | v61.04,42.63 v61.05,42.63 61.05,46.4 62.22,46.4 R5.2
  Bottom 0.305: v50.8,30.4 57.51,30.4 v57.73,30.41 | v58.69,37.87 61.04,37.87 v61.04,42.63
N$1
  Top 1.27: D1.A 74.82,14.01 X9.1
N$2  (via drill 0.5)
  Top 0.406: 74.7,25.53 C1.1
  Top 0.813: 74.7,25.53 IC4.3 | C1.1 74.93,25.6 76.98,25.6 76.98,19.7 v76.99,19.7
  Top 1.016: 67.42,16.73 v69.57,16.73
  Top 1.27: D1.C 67.42,16.73
  Bottom 0.813: v69.57,16.73 69.57,19.7 v76.99,19.7
N$3
  Top 0.406: IC4.2 C2.1 69.85,24.26 SJ3.1
N$4  (via drill 0.5)
  Top 0.305: IC3.14 3.27,35.64 | IC3.14 3.27,35.62 | IC3.14 v1.53,35.62 1.53,44.29 v3.31,44.29 v3.31,44.28
  Bottom 0.305: G1.+$1 5.17,45.19 5.17,44.28 v3.31,44.28 | G1.+$2 7.62,29.49 1.58,29.49 1.58,35.62 v1.53,35.62
N$5
  Bottom 1.27: Q1.D 69.85,41.27 83.23,41.27 83.23,39.33 X10.4
N$6
  Top 0.305: R3.1 62.65,43.62 R4.1 66.04,43.62 66.04,40.64 67.31,40.64 Q1.G
N$7
  Bottom 1.27: 83.25,49.33 X10.6 83.19,50.87 69.85,50.87 Q2.D
N$8
  Top 0.305: T1.C 69.14,2.71 SG1.-
N$9
  Top 0.305: Q2.G 67.31,50.8 66.04,50.8 | 66.04,50.8 66.04,52.84 R6.1 | R5.1 62.22,50.8 66.04,50.8
N$10
  Top 0.305: T1.B 64.45,7.47 R7.1
N$11
  Top 0.305: IC1.8 40.64,27.68 Q3.1 36.46,29.21 C16.2
N$12
  Top 0.305: IC1.7 42.07,28.48 42.07,30.16 40.64,30.16 Q3.2 36.46,34.29 C17.2
N$13
  Top 0.305: D2.K 21.19,4.45 R10.1
N$14
  Top 0.305: D3.K 11.54,4.46 R11.1
N$15  (via drill 0.5)
  Top 0.305: IC7.2 v52.7,8.71 v52.71,8.71
  Bottom 0.305: v52.71,8.71 53.58,8.71 53.58,7.16 IC8.2
N$16  (via drill 0.5)
  Top 0.305: IC7.4 v55.24,8.79 v55.25,8.79
  Bottom 0.305: v55.25,8.79 54.82,8.79 54.82,7.16 IC8.3
N$17  (via drill 0.5)
  Top 0.305: v56.99,8.6 57.78,8.6 IC7.6
  Bottom 0.305: IC8.5 v56.98,8.6 v56.99,8.6
N$18
  Top 0.305: IC2.24 43.18,19.68 Q4.1 43.18,21.97 C13.2
N$19
  Top 0.305: IC2.14 29.21,8.26 R14.2
N$20
  Top 0.305: IC2.23 43.18,18.41 Q4.2 43.18,15.62 C7.1
N$21
  Top 0.305: C9.+ 25.33,24.77 IC2.1
N$22  (via drill 0.6)
  Top 0.305: v19.81,19.29 19.81,21.44 R17.2 21.59,21.59 24.13,21.59 R19.1 | U$1.P4 13.86,16.83 13.86,25.02 16.44,25 16.44,26.4 L1.2 16.43,26.28 19.58,26.28 19.58,25.89 C14.2
  Bottom 0.305: U$1.P4 17.46,17.46 19.8,17.46 19.8,19.29 v19.81,19.29
N$23  (via drill 0.5)
  Top 0.305: R16.2 v10.98,27.94 | v35.08,22.25 37.62,22.25 IC2.26
  Bottom 0.305: v10.98,27.94 35.08,27.94 v35.08,22.25
N$24  (via drill 0.5)
  Top 0.305: R15.2 5.23,25.44 v7.53,25.44 | v34.11,23.61 37.62,23.61 IC2.27
  Bottom 0.305: v7.53,25.44 7.53,25.86 12.17,25.86 34.11,25.86 v34.11,23.61
N$26  (via drill 0.6)
  Top 0.305: v19.9,16.31 v19.9,16.32 21.43,16.32 21.43,17.78 C11.2 | 21.59,11.22 R20.1 21.59,12.55 R18.2 24.15,12.55 | 21.59,10.96 21.59,11.22 | 21.59,11.22 19.15,11.22 19.15,13 16.28,13 16.28,14.32 14.91,14.32 U$1.P5
  Bottom 0.305: U$1.P5 14.92,15.57 19.86,15.57 19.86,16.31 v19.9,16.31
N$42
  Top 0.406: IC5.2 C4.1 62.23,24.26 SJ2.1
ONEWIRE  (via drill 0.4)
  Top 0.254: X8.2 54.5,47.7 41.81,47.7 | R8.2 64.64,52.85 64.64,54.56 64.56,54.64 | IC6.2 71.12,57.07 71.12,54.64 64.56,54.64 | 64.56,54.64 54.53,54.64 54.5,54.67
  Top 0.305: X6.2 X1.2 16.51,59.3 16.51,62.23 29.21,62.23 29.21,59.3 X2.2 X5.2 29.21,50.3 29.22,47.7 41.81,47.7 X7.2 X3.2 | X4.2 54.5,54.67 X8.2 | 71.12,57.2 IC6.2 | IC1.32 49.27,38.69 44.86,38.69 44.86,39.69 44.86,44.76 v41.78,44.76
  Bottom 0.305: v41.78,44.76 41.76,50.3 X7.2
PC0  (via drill 0.5)
  Top 0.305: IC1.23 54.81,32.48 v54.27,32.49
  Bottom 0.305: v54.27,32.49 47.99,32.47 47.99,36.17 42.38,36.17 42.38,38.91 38.58,38.91 X12.1
PC1  (via drill 0.5)
  Top 0.305: IC1.24 55.06,33.27 v54.91,33.27
  Bottom 0.305: v54.91,33.27 48.7,33.27 48.7,36.64 43.12,36.64 43.12,39.37 41.12,39.37 X12.2
PC2  (via drill 0.5)
  Top 0.305: IC1.25 v54.87,37.75 | v47.09,37.94 43.66,37.93 X12.3
  Bottom 0.305: v54.87,37.75 54.84,37.93 v47.09,37.94
PC3  (via drill 0.5)
  Top 0.305: IC1.26 v54.07,36 v54.06,36
  Bottom 0.305: v54.06,36 54.06,37.21 46.22,37.21 46.22,41.7 X12.4
PWM/MOSFET/Q1  (via drill 0.35, 0.5)
  Top 0.305: IC1.1 50.88,33.28 v50.88,31.7 | v57.56,31.71 57.69,31.71 v57.69,36.79 | v60.87,36.84 62.65,36.84 R3.2
  Bottom 0.305: v50.88,31.7 v57.56,31.7 v57.56,31.71 | v57.69,36.79 60.87,36.79 v60.87,36.84
RESET  (via drill 0.5)
  Top 0.305: v56.11,26.39 v56.11,26.4 54.78,27.73 54.78,27.74 53.66,27.74 53.66,28 51.67,28 IC1.29 51.66,39.55 51.66,39.84 57.02,39.84 57.02,39.24 R9.1 | C12.2 45.72,8.89 v48.48,8.89 | v57.15,12.7 v60.96,12.7 | v63.5,15.24 v63.5,19.05
  Bottom 0.305: v56.11,26.39 58.41,26.39 58.41,20.27 59.69,20.27 ISP1.5 v63.5,19.05 | v48.48,8.89 48.48,10.15 49.53,10.16 49.53,11.43 53.34,11.43 53.34,12.7 v57.15,12.7 | v60.96,12.7 60.96,15.24 v63.5,15.24
RST_ETH
  Top 0.305: R13.2 30.48,5.59 30.48,13.34 IC2.10
RXD  (via drill 0.4)
  Top 0.203: IC1.30 51.09,34.77 51.09,36.63 51.22,36.62 51.22,39.53 50.19,39.55 50.2,44.12 v45.73,44.12 v45.74,44.12 | JP5.3 40.16,2.54 v40.16,7.29 | v45.29,16.94 45.28,16.94 45.28,18.85 v45.28,21.09 | v42.74,29.41 42.74,39.77 42.47,39.77 42.48,44.09 v44.06,44.1
  Bottom 0.203: v40.16,7.29 v40.17,7.29 40.17,13.73 45.29,13.73 v45.29,16.94 | v45.28,21.09 45.28,23.15 42.74,23.15 v42.74,29.41 | v44.06,44.1 v45.74,44.12
SCL  (via drill 0.5)
  Top 0.305: R1.1 2.78,53.92 JP6.4 1.24,53.87 1.24,53.86 0.81,53.86 0.81,33.08 IC3.16 3.29,33.08 3.29,29.39 16.94,29.39 16.91,41.39 v21.4,41.39 v21.41,41.39 | 52.49,34.77 IC1.28 v52.46,38.95 | v29.87,41.4 30.13,41.4 30.13,40.19 v36.25,40.19
  Bottom 0.203: 42.14,43.67 36.26,43.67 | 42.14,43.67 | 42.14,43.67 43.21,43.67 43.21,43.48 52.47,43.48 52.47,43.43
  Bottom 0.305: v52.46,38.95 52.47,43.43 | v21.41,41.39 22.22,41.39 22.26,41.39 v29.87,41.39 v29.87,41.4 | v36.25,40.19 arc90 36.26,40.2 36.26,43.67
SDA  (via drill 0.5)
  Top 0.305: JP6.3 2.78,51.4 R2.1 6.12,51.07 6.12,36.25 | IC3.15 3.27,34.42 5.5,34.42 5.5,36.25 6.12,36.25 | 6.12,36.25 15.5,36.25 15.5,42.14 v22.34,42.14 v22.34,42.13 | IC1.27 53.31,34.77 53.31,38.36 54.13,38.36 v54.13,38.95 | v43.33,46.91 34.61,46.91 v34.61,46.9
  Bottom 0.305: v22.34,42.13 29.43,42.13 29.43,42.62 34.62,42.62 v34.61,46.9 | v54.13,38.95 54.13,40.82 54.14,40.82 54.14,46.88 43.33,46.88 v43.33,46.91
SPI/CS/ETHERNET  (via drill 0.4, 0.5)
  Top 0.305: IC1.12 51.67,22 R12.2 50.81,20.55 46.68,20.56 v46.69,20.55 | v35.28,17.82 35.28,14.61 IC2.9
  Bottom 0.305: v46.69,20.55 46.69,17.92 35.29,17.91 v35.28,17.82
SPI/CS/SD  (via drill 0.5)
  Top 0.305: IC7.3 53.97,9.9 53.97,11.22 50.17,11.22 v50.17,17 | v50.17,23.95 50.87,23.95 IC1.11
  Bottom 0.305: v50.17,17 v50.17,23.95
SPI/MISO  (via drill 0.4, 0.5)
  Top 0.254: IC2.6 v31.74,18.42 | v33.3,8.1 34.27,8.1 34.27,4.21 v38.96,4.21
  Top 0.305: v54.89,24 54.89,26.19 IC1.16
  Bottom 0.254: v31.74,18.42 31.74,11.51 33.29,11.51 v33.29,8.1 v33.3,8.1 | v38.96,4.21 47.66,4.21 47.66,1.32 59.18,1.32 IC8.7 59.06,7.16 59.06,16.43 53.54,16.43 53.54,18.97 54.61,18.97 ISP1.1
  Bottom 0.305: ISP1.1 54.61,20.21 55.9,20.21 55.9,24 v54.89,24
SPI/MOSI  (via drill 0.35, 0.4)
  Top 0.254: IC2.7 28.42,17.06 v34.11,17.06 | v41.26,15.85 41.26,14.12 43.23,14.12 43.23,11.12 v47.72,11.12 | v52.53,5.93 52.53,7.01 56.2,7.01 56.2,9.9 IC7.5
  Top 0.305: IC1.15 54.05,26.19 54.05,23.1 57.15,23.1 ISP1.4 55.9,21.59 55.9,9.92 IC7.5
  Bottom 0.254: v34.11,17.06 41.26,17.06 v41.26,15.85 | v47.72,11.12 47.72,7.86 49.55,7.86 49.55,5.93 v52.53,5.93
SPI/SCK  (via drill 0.4, 0.5)
  Top 0.254: ISP1.3 58.42,19.05 58.42,17.78 60.33,17.78 IC7.9 60.23,15.5 60.23,13.9 v58.05,13.9 | IC2.8 28.42,15.89 v33.36,15.89 | v44.07,14.81 44.07,14.2 v47.67,14.2
  Top 0.305: ISP1.3 57.15,20.22 58.43,20.22 58.43,27.68 IC1.17
  Bottom 0.254: v33.36,15.89 40.3,15.89 40.3,14.81 v44.07,14.81 | v47.67,14.2 47.67,14.31 51.29,14.31 51.29,13.9 v58.05,13.9
TPIN+
  Top 0.305: U$1.RD+ 19.05,18.09 19.05,15.39 R18.1 24.13,15.41 25.48,15.4 25.48,9.51 IC2.13
TPIN-  (via drill 0.4, 0.6)
  Top 0.254: 17.46,14.12 U$1.RD-
  Top 0.305: R20.2 21.59,13.98 | 21.59,13.98 v24.15,13.98 | 17.46,14.12 17.46,13.98 21.59,13.98 | v26.52,10.79 IC2.12
  Bottom 0.305: v24.15,13.98 26.09,13.98 26.09,10.79 v26.52,10.79
TPOUT+  (via drill 0.6)
  Top 0.305: U$1.TD+ 14.92,24.28 R17.1 21.59,24.83 v23.95,24.83 | v32.51,10.76 32.51,10.79 IC2.17
  Bottom 0.305: v23.95,24.83 30.99,24.83 30.99,10.76 v32.51,10.76
TPOUT-  (via drill 0.6)
  Top 0.305: U$1.TD- 17.46,23.01 R19.2 | R19.2 | R19.2 24.13,22.91 | 24.13,22.86 24.13,22.91 | 24.13,22.91 v25.79,22.91 | v31.72,9.65 37.62,9.65 IC2.16
  Bottom 0.305: v25.79,22.91 30.24,22.91 30.24,9.64 31.72,9.64 v31.72,9.65
TXD  (via drill 0.35, 0.4, 0.5)
  Top 0.203: IC1.31 50.04,34.77 50.04,35.69 50.55,35.68 50.59,35.68 v50.59,38.73
  Top 0.254: JP5.2 43.88,2.54 v43.88,7.65 | v43.62,29.42 44.88,29.42 v44.88,37.28 | v45.55,39.41 v47.19,39.41 47.19,39.39
  Bottom 0.203: v50.59,38.73 48.17,38.73 48.16,39.41 v47.19,39.41
  Bottom 0.254: v43.88,7.65 46.26,7.65 46.26,14.6 46.26,17.01 47.73,17.01 47.73,23.56 43.61,23.55 v43.62,29.42 | v44.88,37.28 45.55,37.28 v45.55,39.41 | v47.19,39.41
VDD  (via drill 0.5)
  Top 0.813: JP4.2 31.75,45.72 v57.15,45.72
  Top 1.27: X10.1 79.12,24.33 79.12,34.3 | 79.12,34.3 83.2,34.3 X10.3 | 79.12,34.3 v79.12,44.33 X10.5
  Bottom 0.813: v57.15,45.72 79.12,45.72 v79.12,44.33

### Text on the board
tNames: FAN3 | FAN2 | FAN1 | +3,3V | +5V | AVR-ISP | ACT | Power
bNames: developed by: / Marcel Thürmer / Justin Wellenberg / Julian Prochowicz / Till Flesch | MSR Regel Einheit / Temperatur